# Altium schematic sheet LED-12PORT.SchDoc
size A4
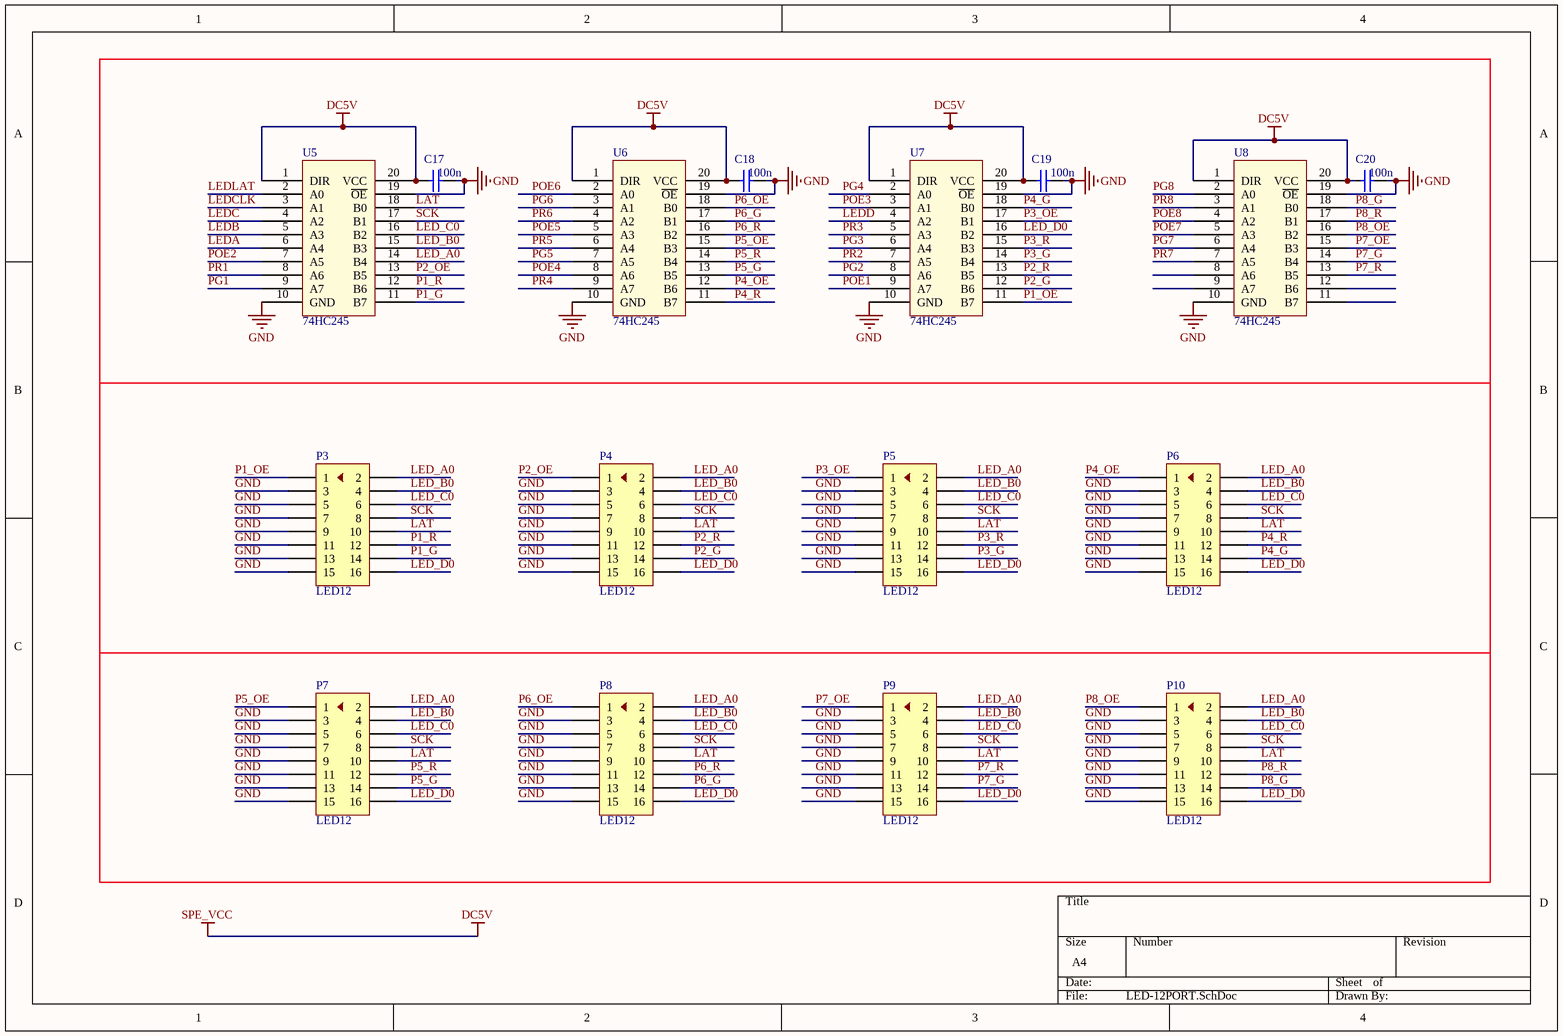
[diagram p0: LED-12PORT.SchDoc]

## Parts
C17  value 100n  [LC-0603_C]  (hidden comment: 104)
C18  value 100n  [LC-0603_C]  (hidden comment: 104)
C19  value 100n  [LC-0603_C]  (hidden comment: 104)
C20  value 100n  [LC-0603_C]  (hidden comment: 104)
P3  LED12  [DC3-16P-2.54mm]
P4  LED12  [DC3-16P-2.54mm]
P5  LED12  [DC3-16P-2.54mm]
P6  LED12  [DC3-16P-2.54mm]
P7  LED12  [DC3-16P-2.54mm]
P8  LED12  [DC3-16P-2.54mm]
P9  LED12  [DC3-16P-2.54mm]
P10  LED12  [DC3-16P-2.54mm]
U5  74HC245  [TSSOP-20]
U6  74HC245  [TSSOP-20]
U7  74HC245  [TSSOP-20]
U8  74HC245  [TSSOP-20]

## Nets
DC5V: C17.2 C18.2 C19.2 C20.2 U5.1(DIR) U5.20(VCC) U6.1(DIR) U6.20(VCC) U7.1(DIR) U7.20(VCC) U8.1(DIR) U8.20(VCC)  [also labelled SPE_VCC]
GND: C17.1 C18.1 C19.1 C20.1 P3.3 P3.5 P3.7 P3.9 P3.11 P3.13 P3.15 P4.3 P4.5 P4.7 P4.9 P4.11 P4.13 P4.15 P5.3 P5.5 P5.7 P5.9 P5.11 P5.13 P5.15 P6.3 P6.5 P6.7 P6.9 P6.11 P6.13 P6.15 P7.3 P7.5 P7.7 P7.9 P7.11 P7.13 P7.15 P8.3 P8.5 P8.7 P8.9 P8.11 P8.13 P8.15 P9.3 P9.5 P9.7 P9.9 P9.11 P9.13 P9.15 P10.3 P10.5 P10.7 P10.9 P10.11 P10.13 P10.15 U5.10(GND) U5.19(~{OE}) U6.10(GND) U6.19(~{OE}) U7.10(GND) U7.19(~{OE}) U8.10(GND) U8.19(~{OE})
LAT: P3.10 P4.10 P5.10 P6.10 P7.10 P8.10 P9.10 P10.10 U5.18(B0)
LED_A0: P3.2 P4.2 P5.2 P6.2 P7.2 P8.2 P9.2 P10.2 U5.14(B4)
LED_B0: P3.4 P4.4 P5.4 P6.4 P7.4 P8.4 P9.4 P10.4 U5.15(B3)
LED_C0: P3.6 P4.6 P5.6 P6.6 P7.6 P8.6 P9.6 P10.6 U5.16(B2)
LED_D0: P3.16 P4.16 P5.16 P6.16 P7.16 P8.16 P9.16 P10.16 U7.16(B2)
LEDA: U5.6(A4)
LEDB: U5.5(A3)
LEDC: U5.4(A2)
LEDCLK: U5.3(A1)
LEDD: U7.4(A2)
LEDLAT: U5.2(A0)
P1_G: P3.14 U5.11(B7)
P1_OE: P3.1 U7.11(B7)
P1_R: P3.12 U5.12(B6)
P2_G: P4.14 U7.12(B6)
P2_OE: P4.1 U5.13(B5)
P2_R: P4.12 U7.13(B5)
P3_G: P5.14 U7.14(B4)
P3_OE: P5.1 U7.17(B1)
P3_R: P5.12 U7.15(B3)
P4_G: P6.14 U7.18(B0)
P4_OE: P6.1 U6.12(B6)
P4_R: P6.12 U6.11(B7)
P5_G: P7.14 U6.13(B5)
P5_OE: P7.1 U6.15(B3)
P5_R: P7.12 U6.14(B4)
P6_G: P8.14 U6.17(B1)
P6_OE: P8.1 U6.18(B0)
P6_R: P8.12 U6.16(B2)
P7_G: P9.14 U8.14(B4)
P7_OE: P9.1 U8.15(B3)
P7_R: P9.12 U8.13(B5)
P8_G: P10.14 U8.18(B0)
P8_OE: P10.1 U8.16(B2)
P8_R: P10.12 U8.17(B1)
PG1: U5.9(A7)
PG2: U7.8(A6)
PG3: U7.6(A4)
PG4: U7.2(A0)
PG5: U6.7(A5)
PG6: U6.3(A1)
PG7: U8.6(A4)
PG8: U8.2(A0)
POE1: U7.9(A7)
POE2: U5.7(A5)
POE3: U7.3(A1)
POE4: U6.8(A6)
POE5: U6.5(A3)
POE6: U6.2(A0)
POE7: U8.5(A3)
POE8: U8.4(A2)
PR1: U5.8(A6)
PR2: U7.7(A5)
PR3: U7.5(A3)
PR4: U6.9(A7)
PR5: U6.6(A4)
PR6: U6.4(A2)
PR7: U8.7(A5)
PR8: U8.3(A1)
SCK: P3.8 P4.8 P5.8 P6.8 P7.8 P8.8 P9.8 P10.8 U5.17(B1)

Not connected (* = marked no-connect by the designer): U8 8(A6) 9(A7) 11(B7) 12(B6)

## Library data of the parts
C17-C20 = Cap: Capacitor; Published: 8-Jun-2000; LatestRevisionDate: 17-Jul-2002; LatestRevisionNote: Re-released for DXP Platform.; PackageReference: RAD-0.3; Publisher: Altium Limited
P3-P10 = Header 8: 接插件; LatestRevisionDate: 17-Jul-2002; LatestRevisionNote: Re-released for DXP Platform.; Publisher: Altium Limited